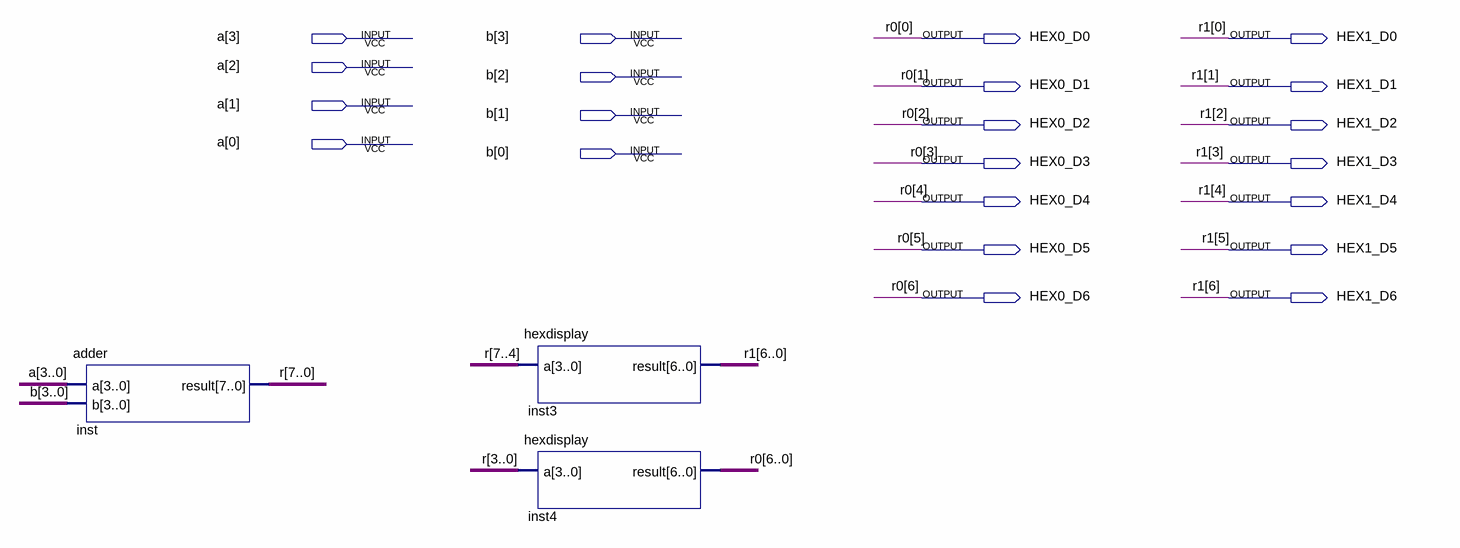
[diagram p0: schematic sheet]
// Quartus schematic task2.bdf as structural Verilog: 3 symbols, 22 pins
module task2 (
  input  [3:0] a,
  input  [3:0] b,
  output HEX0_D0,
  output HEX1_D0,
  output HEX0_D1,
  output HEX1_D1,
  output HEX0_D2,
  output HEX1_D2,
  output HEX0_D3,
  output HEX1_D3,
  output HEX0_D4,
  output HEX1_D4,
  output HEX0_D5,
  output HEX1_D5,
  output HEX0_D6,
  output HEX1_D6
);

  wire [7:0] r;

  adder inst (.a(a), .b(b), .result(r));
  hexdisplay inst3 (.a(r[7:4]), .result({HEX1_D6, HEX1_D5, HEX1_D4, HEX1_D3, HEX1_D2, HEX1_D1, HEX1_D0}));
  hexdisplay inst4 (.a(r[3:0]), .result({HEX0_D6, HEX0_D5, HEX0_D4, HEX0_D3, HEX0_D2, HEX0_D1, HEX0_D0}));

  // Other names for the same wires on the sheet: r0[6:0] = {HEX0_D6, HEX0_D5, HEX0_D4, HEX0_D3, HEX0_D2, HEX0_D1, HEX0_D0};
  //   r1[6:0] = {HEX1_D6, HEX1_D5, HEX1_D4, HEX1_D3, HEX1_D2, HEX1_D1, HEX1_D0}
endmodule
